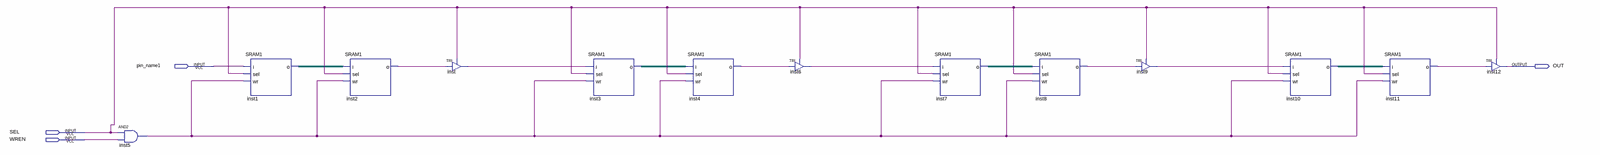
[diagram p0: schematic sheet, whole]
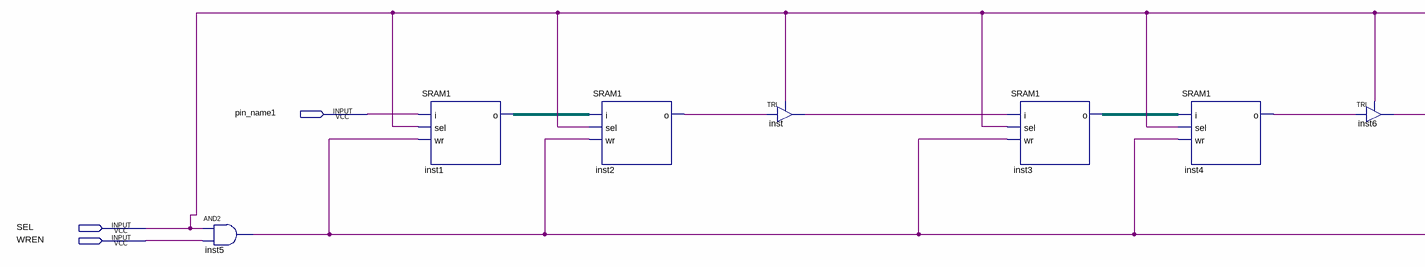
[diagram p1: schematic sheet, left part]
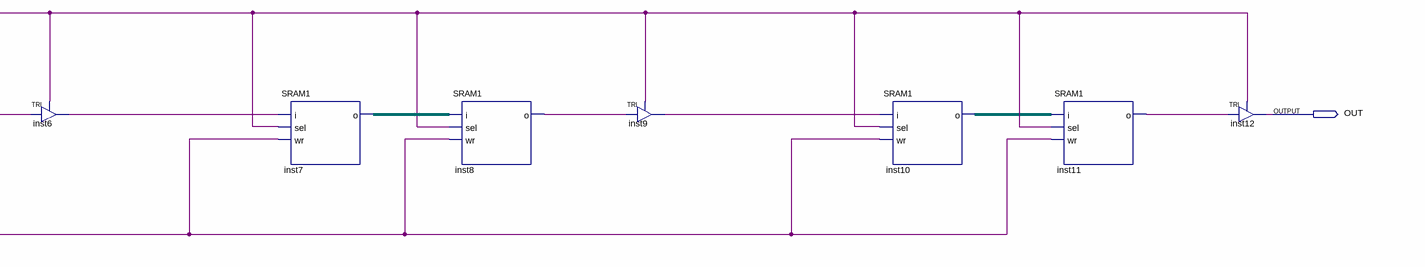
[diagram p2: schematic sheet, right part]
// Quartus schematic 1by4SRAM.bdf as structural Verilog: 13 symbols, 4 pins
module \1by4SRAM  (
  input  pin_name1,
  input  SEL,
  input  WREN,
  output OUT
);

  wire inst2_o, inst4_o, inst5_out, inst6_out, inst8_o, inst9_out, inst11_o, inst_out;

  and inst5 (inst5_out, SEL, WREN);
  SRAM1 inst1 (.i(pin_name1), .sel(SEL), .wr(inst5_out));  // open: o
  SRAM1 inst2 (.sel(SEL), .wr(inst5_out), .o(inst2_o));  // open: i
  TRI inst (.IN(inst2_o), .OE(SEL), .OUT(inst_out));
  SRAM1 inst3 (.i(inst_out), .sel(SEL), .wr(inst5_out));  // open: o
  SRAM1 inst4 (.sel(SEL), .wr(inst5_out), .o(inst4_o));  // open: i
  TRI inst6 (.IN(inst4_o), .OE(SEL), .OUT(inst6_out));
  SRAM1 inst7 (.i(inst6_out), .sel(SEL), .wr(inst5_out));  // open: o
  SRAM1 inst8 (.sel(SEL), .wr(inst5_out), .o(inst8_o));  // open: i
  TRI inst9 (.IN(inst8_o), .OE(SEL), .OUT(inst9_out));
  SRAM1 inst10 (.i(inst9_out), .sel(SEL), .wr(inst5_out));  // open: o
  SRAM1 inst11 (.sel(SEL), .wr(inst5_out), .o(inst11_o));  // open: i
  TRI inst12 (.IN(inst11_o), .OE(SEL), .OUT(OUT));
endmodule
